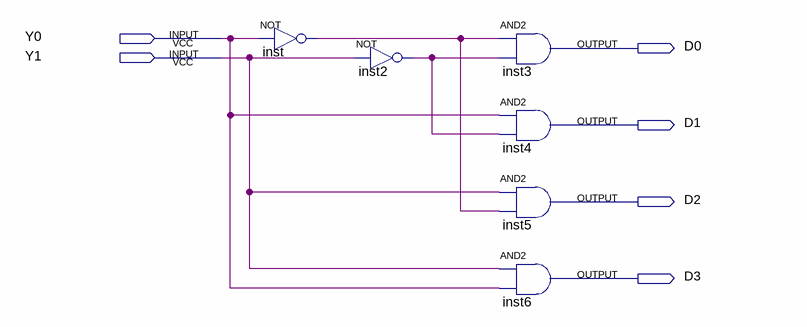
[diagram p0: schematic sheet]
// Quartus schematic 2t4decoder.bdf as structural Verilog: 6 symbols, 6 pins
module \2t4decoder  (
  input  Y0,
  input  Y1,
  output D0,
  output D1,
  output D2,
  output D3
);

  wire inst2_out, inst_out;

  not inst (inst_out, Y0);
  not inst2 (inst2_out, Y1);
  and inst3 (D0, inst_out, inst2_out);
  and inst4 (D1, Y0, inst2_out);
  and inst5 (D2, Y1, inst_out);
  and inst6 (D3, Y1, Y0);
endmodule
